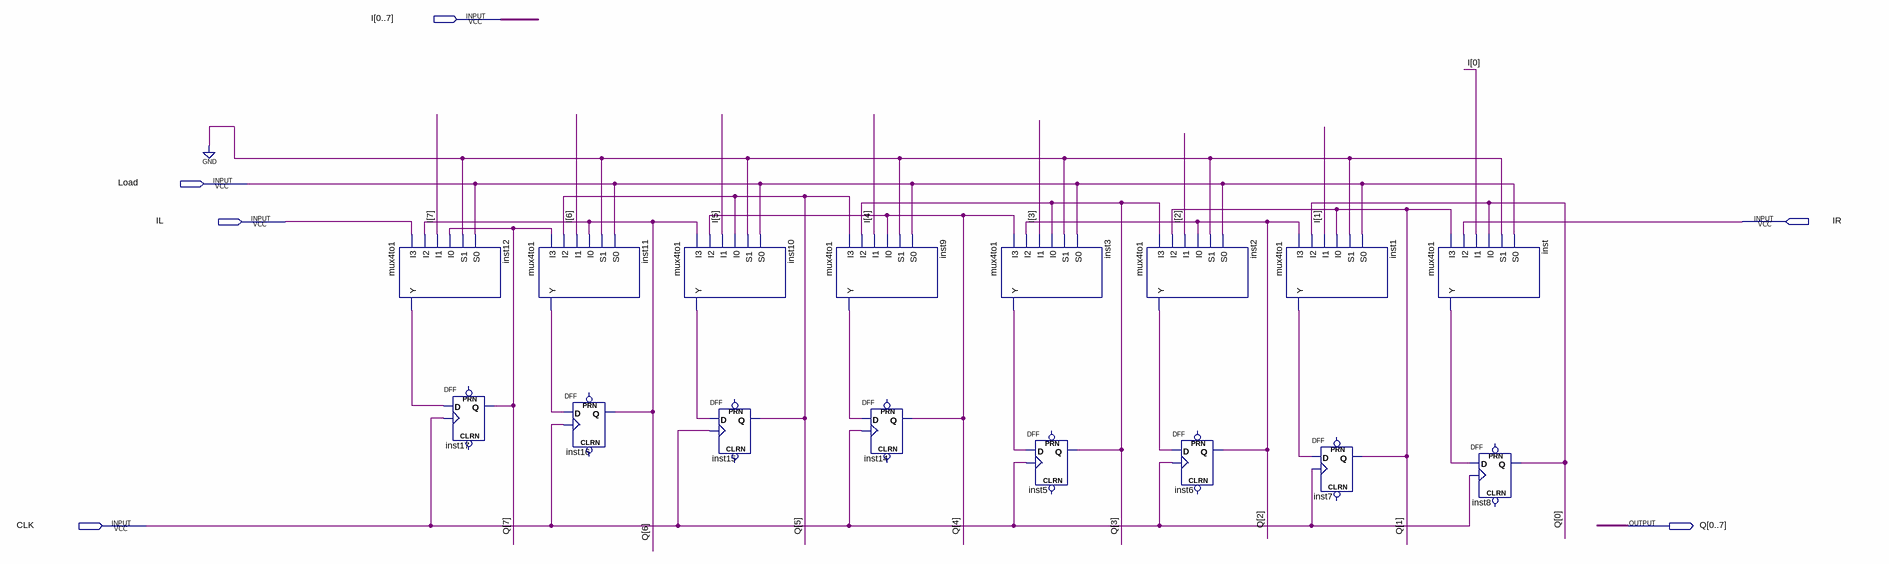
[diagram p0: schematic sheet]
// Quartus schematic Acc.bdf as structural Verilog: 16 symbols, 6 pins
module Acc (
  input  [0:7] I,
  input  Load,
  input  IL,
  input  IR,
  input  CLK,
  output [0:7] Q
);

  wire inst1_y, inst2_y, inst3_y, inst9_y, inst10_y, inst11_y, inst12_y, inst_y;

  mux4to1 inst12 (.I3(IL), .I2(Q[6]), .I1(I[7]), .I0(Q[7]), .S1(1'b0), .S0(Load), .Y(inst12_y));
  DFF inst17 (.CLK(CLK), .D(inst12_y), .Q(Q[7]));  // open: CLRN, PRN
  mux4to1 inst11 (.I3(Q[7]), .I2(Q[5]), .I1(I[6]), .I0(Q[6]), .S1(1'b0), .S0(Load), .Y(inst11_y));
  DFF inst16 (.CLK(CLK), .D(inst11_y), .Q(Q[6]));  // open: CLRN, PRN
  mux4to1 inst10 (.I3(Q[6]), .I2(Q[4]), .I1(I[5]), .I0(Q[5]), .S1(1'b0), .S0(Load), .Y(inst10_y));
  DFF inst15 (.CLK(CLK), .D(inst10_y), .Q(Q[5]));  // open: CLRN, PRN
  mux4to1 inst9 (.I3(Q[5]), .I2(Q[3]), .I1(I[4]), .I0(Q[4]), .S1(1'b0), .S0(Load), .Y(inst9_y));
  DFF inst14 (.CLK(CLK), .D(inst9_y), .Q(Q[4]));  // open: CLRN, PRN
  mux4to1 inst3 (.I3(Q[4]), .I2(Q[2]), .I1(I[3]), .I0(Q[3]), .S1(1'b0), .S0(Load), .Y(inst3_y));
  DFF inst5 (.CLK(CLK), .D(inst3_y), .Q(Q[3]));  // open: CLRN, PRN
  mux4to1 inst2 (.I3(Q[3]), .I2(Q[1]), .I1(I[2]), .I0(Q[2]), .S1(1'b0), .S0(Load), .Y(inst2_y));
  DFF inst6 (.CLK(CLK), .D(inst2_y), .Q(Q[2]));  // open: CLRN, PRN
  mux4to1 inst1 (.I3(Q[2]), .I2(Q[0]), .I1(I[1]), .I0(Q[1]), .S1(1'b0), .S0(Load), .Y(inst1_y));
  DFF inst7 (.CLK(CLK), .D(inst1_y), .Q(Q[1]));  // open: CLRN, PRN
  mux4to1 inst (.I3(Q[1]), .I2(IR), .I1(I[0]), .I0(Q[0]), .S1(1'b0), .S0(Load), .Y(inst_y));
  DFF inst8 (.CLK(CLK), .D(inst_y), .Q(Q[0]));  // open: CLRN, PRN
endmodule
